# Altium schematic sheet ESP_Grow_Main_Rev_B_1_Con.SchDoc: Connectors
size A; Date: 06/02/2019; Author: Kyle R.; Revision: B; SheetNumber: 1; SheetTotal: 3
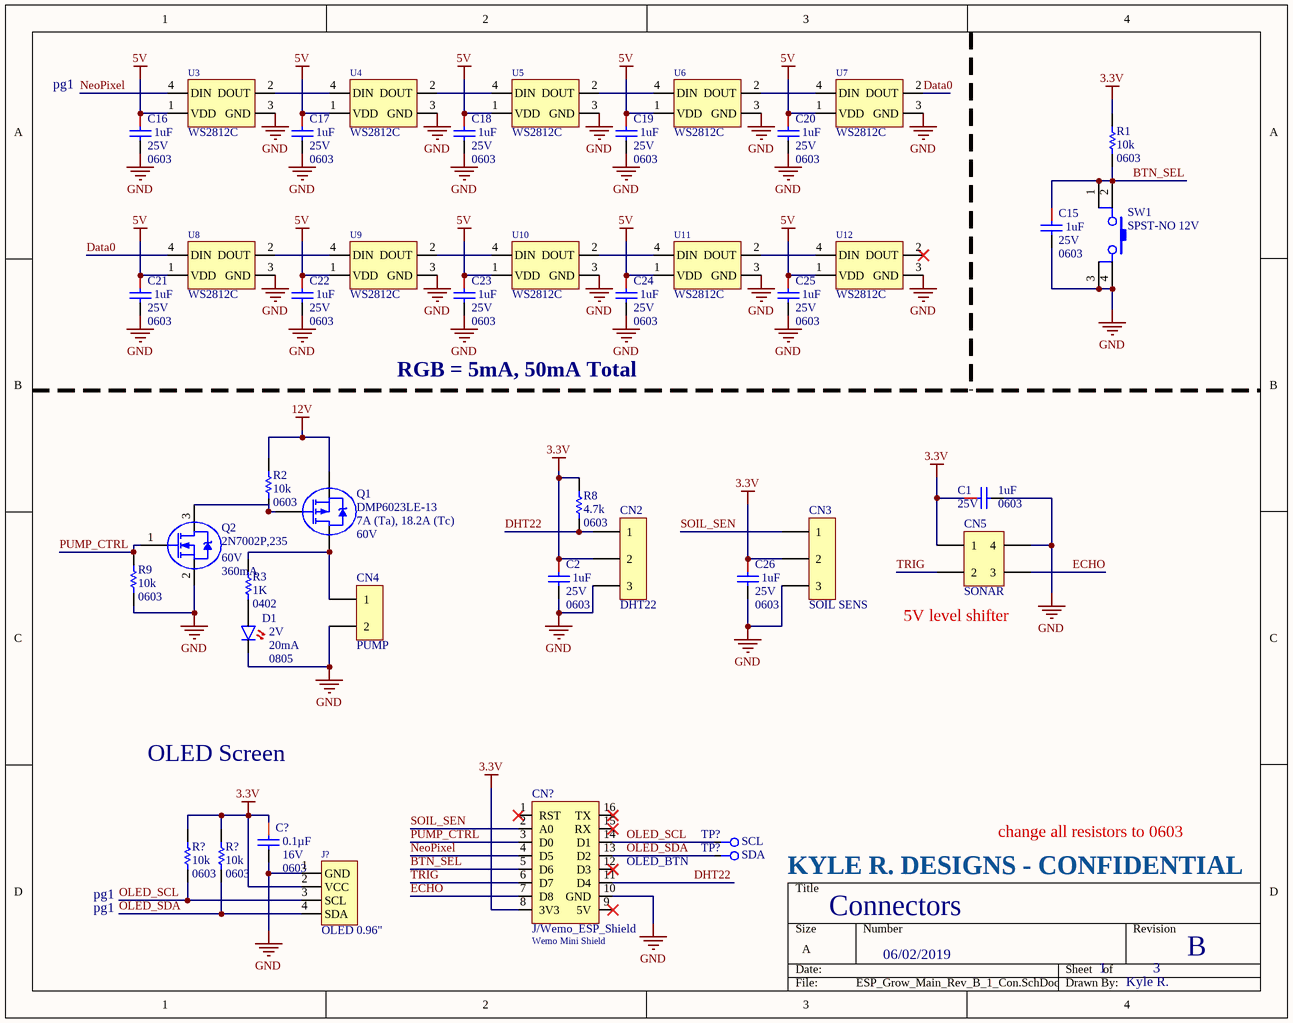
[diagram p0: ESP_Grow_Main_Rev_B_1_Con.SchDoc]

## Parts
(Parts that share a designator on the sheet are numbered #1, #2 ... from top to bottom, then left to right.)
C1  1uF  Voltage - Rated: 25V  Package / Case: 0603  [CAPC0603(1608)_N]
C2  1uF  Voltage - Rated: 25V  Package / Case: 0603  [CAPC0603(1608)_N]
C15  1uF  Voltage - Rated: 25V  Package / Case: 0603  [CAPC0603(1608)_N]
C16  1uF  Voltage - Rated: 25V  Package / Case: 0603  [CAPC0603(1608)_N]
C17  1uF  Voltage - Rated: 25V  Package / Case: 0603  [CAPC0603(1608)_N]
C18  1uF  Voltage - Rated: 25V  Package / Case: 0603  [CAPC0603(1608)_N]
C19  1uF  Voltage - Rated: 25V  Package / Case: 0603  [CAPC0603(1608)_N]
C20  1uF  Voltage - Rated: 25V  Package / Case: 0603  [CAPC0603(1608)_N]
C21  1uF  Voltage - Rated: 25V  Package / Case: 0603  [CAPC0603(1608)_N]
C22  1uF  Voltage - Rated: 25V  Package / Case: 0603  [CAPC0603(1608)_N]
C23  1uF  Voltage - Rated: 25V  Package / Case: 0603  [CAPC0603(1608)_N]
C24  1uF  Voltage - Rated: 25V  Package / Case: 0603  [CAPC0603(1608)_N]
C25  1uF  Voltage - Rated: 25V  Package / Case: 0603  [CAPC0603(1608)_N]
C26  1uF  Voltage - Rated: 25V  Package / Case: 0603  [CAPC0603(1608)_N]
C?  Capacitance: 0.1µF  Package / Case: 0603  Voltage - Rated: 16V  [CAPC0603(1608)_L]  (hidden comment: 0.1uF)
CN2  DHT22  [Molex 1x3 Microfit 90deg]
CN3  SOIL SENS  [Molex 1x3 Microfit 90deg]
CN4  PUMP  [Molex 1x2 Microfit 3.0]
CN5  SONAR  [Molex 2x2 Microfit 90deg]
CN?  J/Wemo_ESP_Shield  Name: Wemo Mini Shield  [Wemos_d1]
D1  Voltage - Forward (Vf) (Typ): 2V  Current - Test: 20mA  Package / Case: 0805  [D/0805]  (hidden comment: D/LEDR/0805)
J?  OLED 0.96"  [OLED_0.96_I2C-Header Only]
Q1  DMP6023LE-13  Current - Continuous Drain (Id) @ 25°C: 7A (Ta), 18.2A (Tc)  Drain to Source Voltage (Vdss): 60V  [SOT-223 - DMP6023LE]
Q2  2N7002P,235  Continuous Drain Current (ID): 360mA  Drain to Source Breakdown Voltage: 60V  [SOT23-3L]
R1  Resistance (Ohms): 10k  Package / Case: 0603  [RESC0603(1608)_N]  (hidden comment: 10K 1%)
R2  Resistance (Ohms): 10k  Package / Case: 0603  [RESC0603(1608)_N]  (hidden comment: 10K 1%)
R3  Package / Case: 0402  [RESC0402(1005)_L]  (hidden comment: 1K)
R8  Package / Case: 0603  [RESC0603(1608)_N]  (hidden comment: 4.7K)
R9  Resistance (Ohms): 10k  Package / Case: 0603  [RESC0603(1608)_N]  (hidden comment: 10K 1%)
R?#1  Resistance (Ohms): 10k  Package / Case: 0603  [RESC0603(1608)_L]  (hidden comment: 10K 1%)
R?#2  Resistance (Ohms): 10k  Package / Case: 0603  [RESC0603(1608)_L]  (hidden comment: 10K 1%)
SW1  SPST-NO 12V  [SW TACT Red 6mm x 6mm]
TP?#1  SCL  [Pogo-Testpoint]  (no BOM)
TP?#2  SDA  [Pogo-Testpoint]  (no BOM)
U3  WS2812C  [WS2812C]
U4  WS2812C  [WS2812C]
U5  WS2812C  [WS2812C]
U6  WS2812C  [WS2812C]
U7  WS2812C  [WS2812C]
U8  WS2812C  [WS2812C]
U9  WS2812C  [WS2812C]
U10  WS2812C  [WS2812C]
U11  WS2812C  [WS2812C]
U12  WS2812C  [WS2812C]

## Nets
3.3V: C1.1 C2.1 C26.1 C?.1 CN2.2 CN3.2 CN5.1 CN?.8(3V3) J?.2(VCC) R1.2 R8.2 R?#1.2 R?#2.2
5V: C16.1 C17.1 C18.1 C19.1 C20.1 C21.1 C22.1 C23.1 C24.1 C25.1 U3.1(VDD) U4.1(VDD) U5.1(VDD) U6.1(VDD) U7.1(VDD) U8.1(VDD) U9.1(VDD) U10.1(VDD) U11.1(VDD) U12.1(VDD)
12V: Q1.S R2.2
GND: C1.2 C2.2 C15.2 C16.2 C17.2 C18.2 C19.2 C20.2 C21.2 C22.2 C23.2 C24.2 C25.2 C26.2 C?.2 CN2.3 CN3.3 CN4.2 CN5.4 CN?.10(GND) D1.1 J?.1(GND) Q2.2(S) R9.1 SW1.3 SW1.4 U3.3(GND) U4.3(GND) U5.3(GND) U6.3(GND) U7.3(GND) U8.3(GND) U9.3(GND) U10.3(GND) U11.3(GND) U12.3(GND)
BTN_SEL: C15.1 CN?.5(D6) R1.1 SW1.1 SW1.2
Data0: U7.2(DOUT) U8.4(DIN)
DHT22: CN2.1 CN?.11(D4) R8.1
ECHO: CN5.3 CN?.7(D8)
NeoPixel: CN?.4(D5) U3.4(DIN)
OLED_SCL: CN?.14(D1) J?.3(SCL) R?#1.1 TP?#1.1
OLED_SDA: CN?.13(D2) J?.4(SDA) R?#2.1 TP?#2.1
PUMP_CTRL: CN?.3(D0) Q2.1(G) R9.2
SOIL_SEN: CN3.1 CN?.2(A0)
TRIG: CN5.2 CN?.6(D7)
NetCN4_1: CN4.1 Q1.D R3.2
NetD1_2: D1.2 R3.1
NetQ1_G: Q1.G Q2.3(D) R2.1
NetU3_2: U3.2(DOUT) U4.4(DIN)
NetU4_2: U4.2(DOUT) U5.4(DIN)
NetU5_2: U5.2(DOUT) U6.4(DIN)
NetU6_2: U6.2(DOUT) U7.4(DIN)
NetU8_2: U8.2(DOUT) U9.4(DIN)
NetU9_2: U9.2(DOUT) U10.4(DIN)
NetU10_2: U10.2(DOUT) U11.4(DIN)
NetU11_2: U11.2(DOUT) U12.4(DIN)

Not connected (* = marked no-connect by the designer): CN? 1(RST)* 9(5V)* 12(D3)* 15(RX)* 16(TX)*; U12 2(DOUT)*

## Notes on the sheet
- pg1
- RGB = 5mA, 50mA Total
- (near CN5) 5V level shifter
- OLED Screen
- change all resistors to 0603
- (near CN?) OLED_BTN
- KYLE R. DESIGNS - CONFIDENTIAL

## Library data of the parts
C1 C2 C15-C26 = CAP CER 1UF 25V 10% X7R 0603: 1uF 0603 25V; Manufacturer: TDK Corporation; Manufacturer Part Number: CGA3E1X7R1E105K080AC; Tolerance: ±10%; Temperature Coefficient: X7R; Supplier 1: Digi-Key; RoHS: RoHS Compliant; Category: Capacitors; Stock 1: 360610; Pricing 1: 1=0.2, 10=0.135, 100=0.0686, 500=0.04696, 1000=0.04154 (USD); Packaging: Cut Tape (CT); Part Status: Active; Operating Temperature: -55°C ~ 125°C; Features: -; Ratings: AEC-Q200; Applications: Automotive; Failure Rate: -; Mounting Type: Surface Mount, MLCC; Size / Dimension: 0.063" L x 0.032" W (1.60mm x 0.80mm); Height - Seated (Max): -; Thickness (Max): 0.035" (0.90mm); Lead Spacing: -; Lead Style: -; ComponentLink1URL: https://product.tdk.com/info/en/catalog/datasheets/mlcc_automotive_general_en.pdf; ComponentLink1Description: https://product.tdk.com/info/en/catalog/datasheets/mlcc_automotive_general_en.pdf; Supplier Part Number 1: 445-6931-1-ND
C? = CAP CER 0.1UF 16V 10% X7R 0603: 0.1uF 0603 16V; Manufacturer: Kemet; Manufacturer Part Number: C0603C104K4RACTU; Tolerance: ±10%; Temperature Coefficient: X7R; Supplier 1: Digi-Key; RoHS: RoHS Compliant; Category: Capacitors; Stock 1: 2360000; Pricing 1: 4000=0.00414, 8000=0.00378, 12000=0.0036, 28000=0.00342, 100000=0.00248 (USD); Packaging: Tape & Reel (TR); Mounting Type: Surface Mount, MLCC; Operating Temperature: -55°C ~ 125°C; Applications: General Purpose; Ratings: -; Size / Dimension: 0.063" L x 0.031" W (1.60mm x 0.80mm); Height - Seated (Max): -; Thickness (Max): 0.034" (0.87mm); Lead Spacing: -; Features: -; Lead Style: -; ComponentLink1URL: http://www.kemet.com/datasheets&C0603C104K4RACTU; ComponentLink1Description: http://www.kemet.com/datasheets&C0603C104K4RACTU; Supplier Part Number 1: 399-1096-2-ND
CN2 CN3 = MICROFIT 3.0 HDR 90deg 3CKT: Molex Microfit 1x3 90deg Header; Manufacturer: Molex Inc; Manufacturer Part Number: 0436500304; Connector Type: Header, Shrouded; Number of Positions: 3; Number of Positions Loaded: All; Pitch: 0.118" (3.00mm); ClassName: *; Supplier 1: Digi-Key; RoHS: RoHS Compliant; Category: Connectors, Interconnects; Stock 1: 42564; Pricing 1: 1=1.39, 10=1.224, 50=1.104, 100=1.056, 250=0.96, 500=0.864, 1000=0.768, 2500=0.696, 5000=0.672 (USD); Packaging: Tray; Contact Type: Male Pin; Number of Rows: 1; Row Spacing: -; Contact Mating Length: -; Mounting Type: Through Hole, Right Angle; Termination: Solder; Fastening Type: Locking Ramp; Features: Board Lock; Contact Finish: Gold; Contact Finish Thickness: 15µin (0.38µm); Color: Black; ComponentLink1URL: http://www.molex.com/pdm_docs/sd/436500304_sd.pdf; ComponentLink1Description: http://www.molex.com/pdm_docs/sd/436500304_sd.pdf; Supplier Part Number 1: WM1876-ND
CN4 = MICROFIT 3.0 HDR VERT CPI 2CKT: Molex Microfit 1x2 Vert Header; Manufacturer: Molex, LLC; Manufacturer Part Number: 0430450227; Shrouding: Shrouded - 4 Wall; Number of Positions: 2; Number of Positions Loaded: All; Row Spacing: 0.118" (3.00mm); Supplier 1: Digi-Key; RoHS: RoHS Compliant; Category: Connectors, Interconnects; Stock 1: 4002; Pricing 1: 1=0.8, 10=0.705, 50=0.636, 100=0.6083, 250=0.553, 500=0.4977, 1000=0.4424, 2500=0.40092, 5000=0.3871 (USD); Packaging: Tray; Part Status: Active; Connector Type: Header; Contact Type: Male Pin; Pitch: -; Number of Rows: 2; Mounting Type: Through Hole; Termination: Solder; Fastening Type: Locking Ramp; Contact Mating Length: -; Features: Board Guide; Contact Finish: Tin; Contact Finish Thickness: 60µin (1.52µm); Color: Black; ComponentLink1URL: http://www.molex.com/pdm_docs/sd/430450227_sd.pdf; ComponentLink1Description: http://www.molex.com/pdm_docs/sd/430450227_sd.pdf; Supplier Part Number 1: WM10657-ND
CN5 = MICROFIT 3.0 HDR 90deg 4CKT: Molex Microfit 2x2 90deg Header; Manufacturer: Molex Inc; Manufacturer Part Number: 0430450400; Connector Type: Header, Shrouded; Number of Positions: 4; Number of Positions Loaded: All; Pitch: 0.118" (3.00mm); ClassName: *; Supplier 1: Digi-Key; RoHS: RoHS Compliant; Category: Connectors, Interconnects; Stock 1: 9668; Pricing 1: 1=1.35, 10=1.228, 50=1.1026, 100=1.0525, 250=0.95228, 500=0.8771, 1000=0.7518, 2500=0.70168, 5000=0.6666 (USD); Packaging: Tray; Contact Type: Male Pin; Number of Rows: 2; Row Spacing: 0.118" (3.00mm); Contact Mating Length: -; Mounting Type: Through Hole, Right Angle; Termination: Solder; Fastening Type: Locking Ramp; Features: Board Lock; Contact Finish: Tin; Contact Finish Thickness: 100µin (2.54µm); Color: Black; ComponentLink1URL: http://www.molex.com/pdm_docs/sd/430450400_sd.pdf; ComponentLink1Description: http://www.molex.com/pdm_docs/sd/430450400_sd.pdf; Supplier Part Number 1: WM1814-ND
CN? = J/Wemo_ESP_Shield: Wemo Mini Shield for ESP-12
D1 = D/LEDR/0805: Red 625nm LED Indication - Discrete 2V 0805; Digikey Part: 732-4984-1-ND; Cost: 0.23; Supplier 1: Digi-Key; Supplier Part Number 1: 732-4984-6-ND
J? = OLED_0.96_I2C: SSD1306 I2C OLED 0.96"
Q1 = DMP6023LE-13: MOSFET P-CH 60V 7A SOT223; Manufacturer: Diodes Incorporated; FET Type: P-Channel; Drive Voltage (Max Rds On,  Min Rds On): 4.5V, 10V; Vgs(th) (Max) @ Id: 3V @ 250µA; Vgs (Max): ±20V; Power Dissipation (Max): 2W (Ta); Rds On (Max) @ Id, Vgs: 28 mOhm @ 5A, 10V; Supplier 1: Digi-Key; Manufacturer Part Number: DMP6023LE-13; RoHS: RoHS Compliant; Category: Discrete Semiconductor Products; Stock 1: 16540; Pricing 1: 1=0.95, 10=0.829, 100=0.6396, 500=0.4738, 1000=0.37904 (USD); Packaging: Cut Tape (CT); Part Status: Active; Technology: MOSFET (Metal Oxide); FET Feature: -; Operating Temperature: -55°C ~ 150°C (TJ); Mounting Type: Surface Mount; Supplier Device Package: SOT-223; Package / Case: TO-261-4, TO-261AA; ComponentLink1URL: https://www.diodes.com/assets/Datasheets/DMP6023LE.pdf; ComponentLink1Description: https://www.diodes.com/assets/Datasheets/DMP6023LE.pdf; Supplier Part Number 1: DMP6023LE-13DICT-ND
Q2 = 2N7002P,235: MOSFET N-CH 60V 0.36A SOT-23; Manufacturer: NXP Semiconductors; Rds On Max: 1.6R; Input Capacitance: 50pF; Rise Time: 4ns; Power Dissipation: 420mW; Max Power Dissipation: 350mW; Number of Elements: 1; Turn-On Delay Time: 3ns; Turn-Off Delay Time: 10ns; Fall Time: 5ns; Gate to Source Voltage (Vgs): 20V; FET Type: N-Channel; Current - Continuous Drain (Id) @ 25°C: 360mA (Ta); Drive Voltage (Max Rds On,  Min Rds On): 10V; Vgs(th) (Max) @ Id: 2.4V @ 250µA; Vgs (Max): ±20V; Power Dissipation (Max): 350mW (Ta); Rds On (Max) @ Id, Vgs: 1.6 Ohm @ 500mA, 10V; ComponentLink1URL: http://assets.nexperia.com/documents/data-sheet/2N7002P.pdf; ComponentLink1Description: http://assets.nexperia.com/documents/data-sheet/2N7002P.pdf; ComponentLink2URL: https://datasheet.ciiva.com/4439/2n7002p-99415-4439248.pdf; ComponentLink2Description: https://datasheet.ciiva.com/4439/2n7002p-99415-4439248.pdf; ComponentLink3URL: https://datasheet.ciiva.com/6371/2n7002p-6371141.pdf; ComponentLink3Description: https://datasheet.ciiva.com/6371/2n7002p-6371141.pdf; ComponentLink4URL: https://datasheet.ciiva.com/49067/getdatasheetpartid-765733-49067862.pdf; ComponentLink4Description: https://datasheet.ciiva.com/49067/getdatasheetpartid-765733-49067862.pdf; ComponentLink5URL: https://datasheet.ciiva.com/11168/2n7002p-11168552.pdf; ComponentLink5Description: https://datasheet.ciiva.com/11168/2n7002p-11168552.pdf; ComponentLink6URL: https://datasheet.ciiva.com/26921/getdatasheetpartid-765733-26921227.pdf; ComponentLink6Description: https://datasheet.ciiva.com/26921/getdatasheetpartid-765733-26921227.pdf; ComponentLink7URL: https://datasheet.ciiva.com/15216/getdatasheetpartid-496132-15216636.pdf; ComponentLink7Description: https://datasheet.ciiva.com/15216/getdatasheetpartid-496132-15216636.pdf; ComponentLink8URL: https://datasheet.ciiva.com/46633/discretesemiconductors-46633181.pdf; ComponentLink8Description: https://datasheet.ciiva.com/46633/discretesemiconductors-46633181.pdf; Supplier 1: Digi-Key; Supplier Part Number 1: 568-11588-1-ND; Manufacturer Part Number: 2N7002P,235; Stock 1: 109268; Pricing 1: 1=0.14, 10=0.128, 100=0.07, 500=0.043, 1000=0.0294 (USD); Case/Package: SOT; Number of Pins: 3; Contact Plating: Tin; Min Operating Temperature: -55°C; Max Operating Temperature: 150°C; Package Quantity: 10000; Packaging: Tape and Reel; Max Dual Supply Voltage: 60V; Drain to Source Voltage (Vdss): 60V; Drain to Source Resistance: 1.6R; Radiation Hardening: No; Lead Free: Lead Free; Supplier 2: Digi-Key; RoHS: RoHS Compliant; Category: Discrete Semiconductor Products; Stock 2: 177811; Pricing 2: 1=0.16, 10=0.148, 100=0.0969, 500=0.04738, 1000=0.03231 (USD); Part Status: Active; Technology: MOSFET (Metal Oxide); FET Feature: -; Operating Temperature: -55°C ~ 150°C (TJ); Mounting Type: Surface Mount; Supplier Device Package: TO-236AB (SOT23); Package / Case: TO-236-3, SC-59, SOT-23-3; ComponentLink9URL: https://assets.nexperia.com/documents/data-sheet/2N7002P.pdf; ComponentLink9Description: https://assets.nexperia.com/documents/data-sheet/2N7002P.pdf; Supplier Part Number 2: 1727-1865-1-ND
R1 R2 R9 R?#1 R?#2 = RES 10K OHM 1/10W 1% 0603 SMD: 10K 0603; Manufacturer: Panasonic Electronic Components; Manufacturer Part Number: ERJ-3EKF1002V; Power (Watts): 0.1W, 1/10W; Temperature Coefficient: ±100ppm/°C; Category: Resistors; Supplier 1: Digi-Key; RoHS: RoHS Compliant; Stock 1: 5046430; Pricing 1: 1=0.1, 50=0.015, 100=0.0114, 250=0.00844, 500=0.00624, 1000=0.00416, 2500=0.00351 (USD); Packaging: Cut Tape (CT); Tolerance: ±1%; Composition: Thick Film; Features: -; Supplier Device Package: 0603; Size / Dimension: 0.063" L x 0.031" W (1.60mm x 0.80mm); Height: 0.022" (0.55mm); Number of Terminations: 2; ComponentLink1URL: http://industrial.panasonic.com/www-cgi/jvcr13pz.cgi?E+PZ+3+AOA0002+ERJ3EKF1002V+7+WW; ComponentLink1Description: http://industrial.panasonic.com/www-cgi/jvcr13pz.cgi?E+PZ+3+AOA0002+ERJ3EKF1002V+7+WW; Supplier Part Number 1: P10.0KHCT-ND
R3 = RES 1K OHM 1% 1/16W 0402: 1K 0402; Manufacturer: Yageo; Manufacturer Part Number: RC0402FR-071KL; Tolerance: 1%; Temperature Coefficient: 100ppm/°C; Power Rating: 62.5mW; Voltage Rating: 50V; ComponentLink1URL: https://datasheet.ciiva.com/2453/pyu-r-int-thick-7-2453361.pdf; ComponentLink1Description: https://datasheet.ciiva.com/2453/pyu-r-int-thick-7-2453361.pdf; ComponentLink2URL: https://datasheet.ciiva.com/2453/pyu-r-int-thick-7-2453362.pdf; ComponentLink2Description: https://datasheet.ciiva.com/2453/pyu-r-int-thick-7-2453362.pdf; ComponentLink3URL: https://datasheet.ciiva.com/2453/pyu-r-int-thick-7-2453363.pdf; ComponentLink3Description: https://datasheet.ciiva.com/2453/pyu-r-int-thick-7-2453363.pdf; ComponentLink4URL: https://datasheet.ciiva.com/22747/1018594-22747509.pdf; ComponentLink4Description: https://datasheet.ciiva.com/22747/1018594-22747509.pdf; ComponentLink5URL: https://datasheet.ciiva.com/15189/getdatasheetpartid-323696-15189334.pdf; ComponentLink5Description: https://datasheet.ciiva.com/15189/getdatasheetpartid-323696-15189334.pdf; ComponentLink6URL: https://datasheet.ciiva.com/16740/pyu-rc0402-51-rohs-l-6-r-16740567.pdf; ComponentLink6Description: https://datasheet.ciiva.com/16740/pyu-rc0402-51-rohs-l-6-r-16740567.pdf; ComponentLink7URL: https://datasheet.ciiva.com/12667/pyu-rc0402-51-rohs-l-6-r-12667930.pdf; ComponentLink7Description: https://datasheet.ciiva.com/12667/pyu-rc0402-51-rohs-l-6-r-12667930.pdf; ComponentLink8URL: https://datasheet.ciiva.com/11819/0900766b80c66297-11819452.pdf; ComponentLink8Description: https://datasheet.ciiva.com/11819/0900766b80c66297-11819452.pdf; Supplier 1: Digi-Key; Supplier Part Number 1: 311-1.00KLRCT-ND; Stock 1: 21888659; Pricing 1: 1=0.1, 10=0.014, 100=0.0056, 1000=0.0025, 2500=0.0022, 5000=0.0018 (USD); Case/Package: 0402; Number of Pins: 2; Case Code (Imperial): 0402; Case Code (Metric): 1005; Min Operating Temperature: -55°C; Max Operating Temperature: 155°C; Packaging: Tape and Reel; Composition: Thick Film; Voltage Rating (DC): 50V; Termination: SMD/SMT; Military Standard: Not; Length: 1mm; Height: 0.32mm; Width: 0.5mm; Depth: 0.5mm; REACH SVHC: Unknown; Lead Free: Lead Free; ComponentLink9URL: https://datasheet.ciiva.com/11819/0900766b80c66297-11819477.pdf; ComponentLink9Description: https://datasheet.ciiva.com/11819/0900766b80c66297-11819477.pdf; ComponentLink10URL: https://datasheet.ciiva.com/12666/pyu-rc0402-51-rohs-l-6-r-12666741.pdf; ComponentLink10Description: https://datasheet.ciiva.com/12666/pyu-rc0402-51-rohs-l-6-r-12666741.pdf; ComponentLink11URL: https://datasheet.ciiva.com/17063/pyu-rc0402-51-rohs-l-6-r-17063193.pdf; ComponentLink11Description: https://datasheet.ciiva.com/17063/pyu-rc0402-51-rohs-l-6-r-17063193.pdf; ComponentLink12URL: https://datasheet.ciiva.com/22747/1018594-22747513.pdf; ComponentLink12Description: https://datasheet.ciiva.com/22747/1018594-22747513.pdf; ComponentLink13URL: https://datasheet.ciiva.com/7849/1018594-7849869.pdf; ComponentLink13Description: https://datasheet.ciiva.com/7849/1018594-7849869.pdf; ComponentLink14URL: https://datasheet.ciiva.com/7983/1018594-7983502.pdf; ComponentLink14Description: https://datasheet.ciiva.com/7983/1018594-7983502.pdf; ComponentLink15URL: https://datasheet.ciiva.com/7849/1018594-7849871.pdf; ComponentLink15Description: https://datasheet.ciiva.com/7849/1018594-7849871.pdf; Category: Resistors; Resistance: 1K
R8 = RES 4.7K OHM 1/10W 5% 0603 SMD: 4.7K 0603; Manufacturer: Panasonic Electronic Components; Manufacturer Part Number: ERJ-3GEYJ472V; Tolerance: ±5%; Power (Watts): 0.1W, 1/10W; Temperature Coefficient: ±200ppm/°C; Supplier 1: Digi-Key; RoHS: RoHS Compliant; Category: Resistors; Stock 1: 1261582; Pricing 1: 1=0.1, 50=0.0126, 100=0.0096, 250=0.00716, 500=0.00528, 1000=0.00352, 2500=0.00297 (USD); Packaging: Cut Tape (CT); Resistance (Ohms): 4.7k; Composition: Thick Film; Features: Automotive AEC-Q200 Qualified; Supplier Device Package: 0603; Size / Dimension: 0.063" L x 0.031" W (1.60mm x 0.80mm); Height: 0.022" (0.55mm); Number of Terminations: 2; ComponentLink1URL: http://industrial.panasonic.com/www-cgi/jvcr13pz.cgi?E+PZ+3+AOA0001+ERJ3GEYJ472V+7+WW; ComponentLink1Description: http://industrial.panasonic.com/www-cgi/jvcr13pz.cgi?E+PZ+3+AOA0001+ERJ3GEYJ472V+7+WW; Supplier Part Number 1: P4.7KGCT-ND
SW1 = PTS645SM43SMTR92 LFS: SWITCH TACTILE SPST-NO 0.05A 12V; Manufacturer: C&K; Switch Function: Off-Mom; Contact Rating @ Voltage: 0.05A @ 12VDC; Actuator Type: Standard; Actuator Height off PCB, Vertical: 4.30mm; Actuator Orientation: Top Actuated; Outline: 6.00mm x 6.00mm; Illumination: Non-Illuminated; Operating Force: 160gf; Actuator Material: Polyamide (PA66), Nylon 6/6; Mechanical Life: 100,000 Cycles; ClassName: *; Supplier 1: Digi-Key; Manufacturer Part Number: PTS645SM43SMTR92 LFS; RoHS: RoHS Compliant; Category: Switches; Stock 1: 234699; Pricing 1: 1=0.15, 10=0.147, 25=0.1416, 50=0.1366, 100=0.129, 250=0.12144, 500=0.11638 (USD); Packaging: Cut Tape (CT); Part Status: Active; Circuit: SPST-NO; Mounting Type: Surface Mount; Actuator Length, Right Angle: -; Termination Style: Gull Wing; Illumination Type, Color: -; Illumination Voltage (Nominal): -; Ingress Protection: -; Features: Blue Actuator; Switch Travel: -; Operating Temperature: -20°C ~ 60°C; ComponentLink1URL: http://www.ckswitches.com/media/1471/pts645.pdf; ComponentLink1Description: http://www.ckswitches.com/media/1471/pts645.pdf; Supplier Part Number 1: CKN9112CT-ND
TP?#1 TP?#2 = CMP-001-0557-03: Test Point- Current one; Pin Count: 1; Component Name: TestPoint; Designator: TestPoint
U3-U12 = WS2812C: Serial RGB LED; RGB Current: 5mA; Voltage: 3.5V ~ 5.3V; RED Brightness: 60mcd; GREEN Brightness: 245mcd; BLUE Brightness: 65 mcd; White Brightness: 365 mcd; LCSC: C114587; Datasheet: https://datasheet.lcsc.com/szlcsc/Worldsemi-WS2812C_C114587.pdfhttps://datasheet.lcsc.com/szlcsc/Worldsemi-WS2812C_C114587.pdf